# EAGLE schematic serialaudio (EAGLE 6.2)
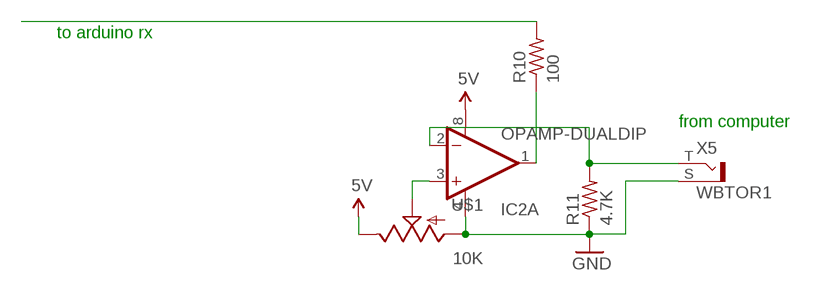
[diagram p0: schematic, sheet 1]

## Parts
IC2  OPAMP-DUALDIP  [DIP08]
R10  100  R-US_0204/2V  [0204V]
R11  4.7K  R-US_0204/2V  [0204V]
U$1  10K  POTTRIM  [TRIM_POT]
X5  WBTOR1  [WBTOR1]

## Nets
5V: IC2.8(A:V+) U$1.2(E)
GND: IC2.4(A:V-) R11.1 U$1.3(A) X5.S
N$1: IC2.2(A:-IN) R11.2 X5.T
N$2: IC2.1(A:OUT) R10.1
N$5: R10.2
N$45: IC2.3(A:+IN) U$1.1(S)
Unconnected: IC2.5(B:+IN) IC2.6(B:-IN) IC2.7(B:OUT)

## Notes on the sheet
- to arduino rx
- from computer

## Library data of the parts
IC2 = SparkFun-AnalogIC:OPAMP-DUAL: Generic op-amp footprint
R10 R11 = resistor:R-US_: RESISTOR, American symbol
U$1 = SparkFun:POT
X5 = con-lumberg:WBTOR1: RCA connectors according to JEITA RC-5231 Cinch RCA-Einbaukupplung nach JEITA RC-5231, abgewinkelte Ausführung Source: http://www.lumberg.de/Produkte/PDFs/WBTOR1.pdf; MPN: WBTOR 1 BLACK; OC_FARNELL: 1200146; OC_NEWARK: 98K2588